# EAGLE design fc-hat-3v3fix (EAGLE 9.5.2)
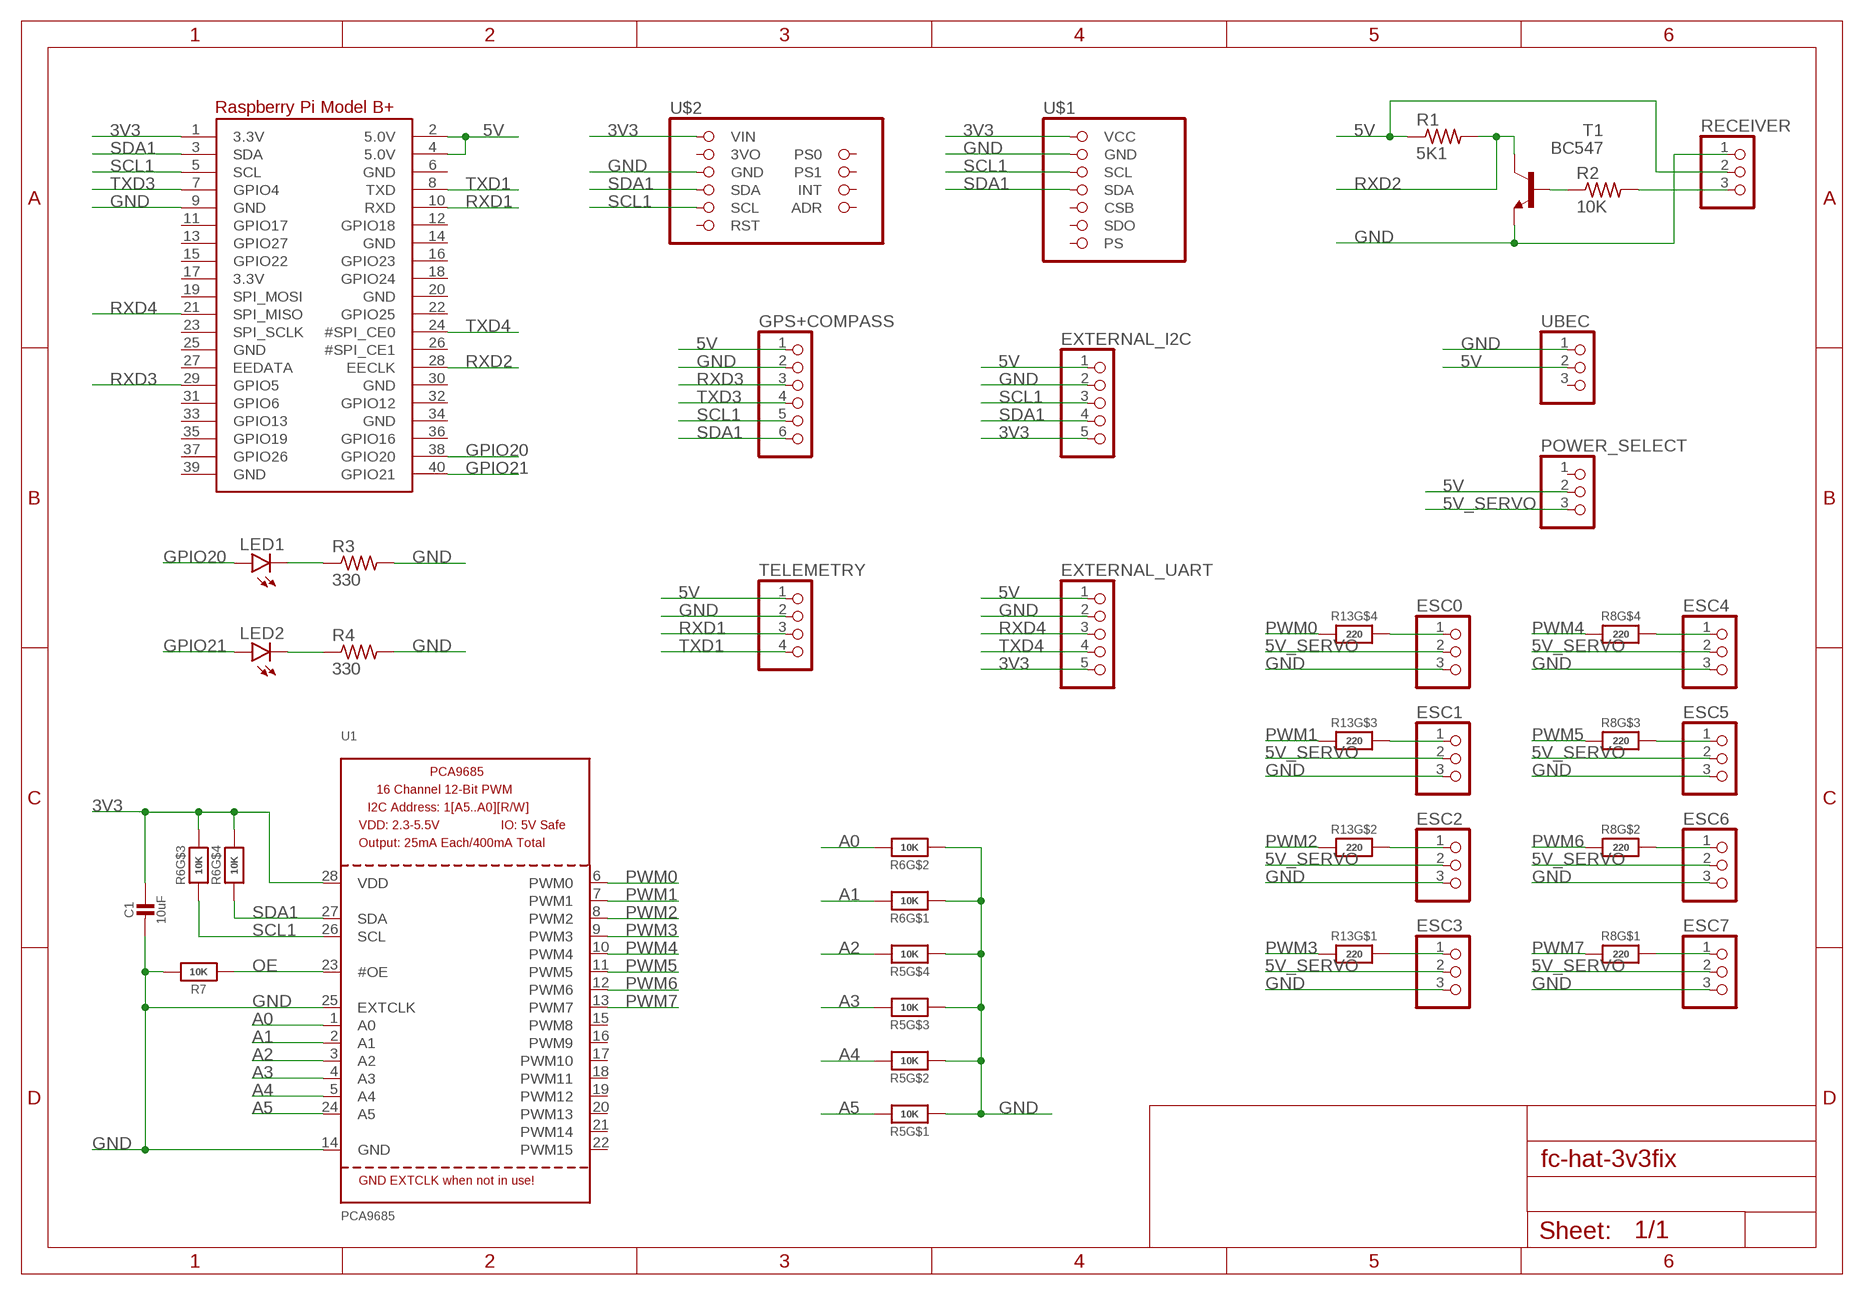
[diagram p0: schematic, sheet 1]

## Parts
C1  10uF  CAP_CERAMIC0805-NOOUTLINE  [0805-NO]
ESC0  PINHD-1X31X03_ROUND  [1X03_ROUND]
ESC1  PINHD-1X31X03_ROUND  [1X03_ROUND]
ESC2  PINHD-1X31X03_ROUND  [1X03_ROUND]
ESC3  PINHD-1X31X03_ROUND  [1X03_ROUND]
ESC4  PINHD-1X31X03_ROUND  [1X03_ROUND]
ESC5  PINHD-1X31X03_ROUND  [1X03_ROUND]
ESC6  PINHD-1X31X03_ROUND  [1X03_ROUND]
ESC7  PINHD-1X31X03_ROUND  [1X03_ROUND]
EXTERNAL_I2C  PINHD-1X51X05_ROUND  [1X05_ROUND]
EXTERNAL_UART  PINHD-1X51X05_ROUND  [1X05_ROUND]
GPS+COMPASS  PINHD-1X61X06_ROUND  [1X06_ROUND]
LED1  LED5MM  [LED5MM]
LED2  LED5MM  [LED5MM]
POWER_SELECT  PINHD-1X31X03_ROUND  [1X03_ROUND]
R1  5K1  R-US_0207/10  [0207/10]
R2  10K  R-US_0207/10  [0207/10]
R3  330  R-US_0207/10  [0207/10]
R4  330  R-US_0207/10  [0207/10]
R5  10K  RESISTOR_4PACK  [RESPACK_4X0603]
R6  10K  RESISTOR_4PACK  [RESPACK_4X0603]
R7  10K  RESISTOR0805_NOOUTLINE  [0805-NO]
R8  220  RESISTOR_4PACK  [RESPACK_4X0603]
R13  220  RESISTOR_4PACK  [RESPACK_4X0603]
RECEIVER  PINHD-1X31X03_ROUND  [1X03_ROUND]
RPI1  MICROBUILDER_RASPBERRYPI_BPLUS_HATNOSLOTS  [MICROBUILDER_PI_HAT_NOSLOTS]
T1  BC547  [TO92]
TELEMETRY  PINHD-1X41X04_ROUND  [1X04_ROUND]
U1  PCA9685  [TSSOP28]
U$1  GY-63  [GY-63]
U$2  BNO055  [BNO055]
UBEC  PINHD-1X31X03_ROUND  [1X03_ROUND]

## Nets
3V3: C1.1 EXTERNAL_I2C.5 EXTERNAL_UART.5 R6.5 R6.6 RPI1.1(3.3V) U1.28(VDD) U$1.VCC U$2.VIN
5V: EXTERNAL_I2C.1 EXTERNAL_UART.1 GPS+COMPASS.1 POWER_SELECT.2 R1.1 RECEIVER.2 RPI1.2(5.0V) RPI1.4(5.0V) TELEMETRY.1 UBEC.2
5V_SERVO: ESC0.2 ESC1.2 ESC2.2 ESC3.2 ESC4.2 ESC5.2 ESC6.2 ESC7.2 POWER_SELECT.3
A0: R6.7 U1.1(A0)
A1: R6.8 U1.2(A1)
A2: R5.5 U1.3(A2)
A3: R5.6 U1.4(A3)
A4: R5.7 U1.5(A4)
A5: R5.8 U1.24(A5)
GND: C1.2 ESC0.3 ESC1.3 ESC2.3 ESC3.3 ESC4.3 ESC5.3 ESC6.3 ESC7.3 EXTERNAL_I2C.2 EXTERNAL_UART.2 GPS+COMPASS.2 R3.2 R4.2 R5.1 R5.2 R5.3 R5.4 R6.1 R6.2 R7.2 RECEIVER.1 RPI1.9(GND) T1.1(E) TELEMETRY.2 U1.14(GND) U1.25(EXTCLK) U$1.GND U$2.GND UBEC.1
GPIO20: LED1.A RPI1.38(GPIO20)
GPIO21: LED2.A RPI1.40(GPIO21)
N$1: R2.2 RECEIVER.3
N$2: R2.1 T1.2(B)
N$3: LED1.K(C) R3.1
N$4: LED2.K(C) R4.1
N$5: ESC7.1 R8.8
N$6: ESC6.1 R8.7
N$7: ESC5.1 R8.6
N$8: ESC4.1 R8.5
N$10: ESC3.1 R13.8
N$11: ESC2.1 R13.7
N$12: ESC1.1 R13.6
N$13: ESC0.1 R13.5
OE: R7.1 U1.23(#OE)
PWM0: R13.4 U1.6(PWM0)
PWM1: R13.3 U1.7(PWM1)
PWM2: R13.2 U1.8(PWM2)
PWM3: R13.1 U1.9(PWM3)
PWM4: R8.4 U1.10(PWM4)
PWM5: R8.3 U1.11(PWM5)
PWM6: R8.2 U1.12(PWM6)
PWM7: R8.1 U1.13(PWM7)
RXD1: RPI1.10(RXD) TELEMETRY.3
RXD2: R1.2 RPI1.28(EECLK) T1.3(C)
RXD3: GPS+COMPASS.3 RPI1.29(GPIO5)
RXD4: EXTERNAL_UART.3 RPI1.21(SPI_MISO)
SCL1: EXTERNAL_I2C.3 GPS+COMPASS.5 R6.3 RPI1.5(SCL) U1.26(SCL) U$1.SCL U$2.SCL
SDA1: EXTERNAL_I2C.4 GPS+COMPASS.6 R6.4 RPI1.3(SDA) U1.27(SDA) U$1.SDA U$2.SDA
TXD1: RPI1.8(TXD) TELEMETRY.4
TXD3: GPS+COMPASS.4 RPI1.7(GPIO4)
TXD4: EXTERNAL_UART.4 RPI1.24(#SPI_CE0)
Unconnected: POWER_SELECT.1 RPI1.6(GND) RPI1.11(GPIO17) RPI1.12(GPIO18) RPI1.13(GPIO27) RPI1.14(GND) RPI1.15(GPIO22) RPI1.16(GPIO23) RPI1.17(3.3V) RPI1.18(GPIO24) RPI1.19(SPI_MOSI) RPI1.20(GND) RPI1.22(GPIO25) RPI1.23(SPI_SCLK) RPI1.25(GND) RPI1.26(#SPI_CE1) RPI1.27(EEDATA) RPI1.30(GND) RPI1.31(GPIO6) RPI1.32(GPIO12) RPI1.33(GPIO13) RPI1.34(GND) RPI1.35(GPIO19) RPI1.36(GPIO16) RPI1.37(GPIO26) RPI1.39(GND) U1.15(PWM8) U1.16(PWM9) U1.17(PWM10) U1.18(PWM11) U1.19(PWM12) U1.20(PWM13) U1.21(PWM14) U1.22(PWM15) U$1.CSB U$1.PS U$1.SDO U$2.3VO U$2.ADR U$2.INT U$2.PS0 U$2.PS1 U$2.RST UBEC.3

## Library data of the parts
C1 = microbuilder:CAP_CERAMIC: Ceramic Capacitors For new designs, use the packages preceded by an '_' character since they are more reliable: The following footprints should be used on most boards: _0402 - Standard footprint for regular board layouts _0603 - Standard footprint for regular board layouts _0805 - Standard footprint for regular board layouts _1206 - Standard footprint for regular board layouts For extremely tight-pitch boards where space is at a premium, the following 'micro-pitch' footprints can be used (smaller pads, no silkscreen outline, etc.): _0402MP - Micro-pitch footprint for very dense/compact boards _0603MP - Micro-pitch footprint for very dense/compact boards _0805MP - Micro-pitch footprint for very dense/compact boards _1206MP - Micro-pitch footprint for very dense/compact boards
ESC0 ESC1-ESC7 POWER_SELECT RECEIVER UBEC = custom_pinhead:PINHD-1X3: PIN HEADER
EXTERNAL_I2C EXTERNAL_UART = custom_pinhead:PINHD-1X5: PIN HEADER
GPS+COMPASS = custom_pinhead:PINHD-1X6: PIN HEADER
LED1 LED2 = led:LED: LED OSRAM: - CHIPLED LG R971, LG N971, LY N971, LG Q971, LY Q971, LO R971, LY R971 LH N974, LH R974 LS Q976, LO Q976, LY Q976 LO Q996 - Hyper CHIPLED LW Q18S LB Q993, LB Q99A, LB R99A - SideLED LS A670, LO A670, LY A670, LG A670, LP A670 LB A673, LV A673, LT A673, LW A673 LH A674 LY A675 LS A676, LA A676, LO A676, LY A676, LW A676 LS A679, LY A679, LG A679 - Hyper Micro SIDELED® LS Y876, LA Y876, LO Y876, LY Y876 LT Y87S - SmartLED LW L88C, LW L88S LB L89C, LB L89S, LG L890 LS L89K, LO L89K, LY L89K LS L896, LA L896, LO L896, LY L896 - TOPLED LS T670, LO T670, LY T670, LG T670, LP T670 LSG T670, LSP T670, LSY T670, LOP T670, LYG T670 LG T671, LOG T671, LSG T671 LB T673, LV T673, LT T673, LW T673 LH T674 LS T676, LA T676, LO T676, LY T676, LB T676, LH T676, LSB T676, LW T676 LB T67C, LV T67C, LT T67C, LS T67K, LO T67K, LY T67K, LW E67C LS E67B, LA E67B, LO E67B, LY E67B, LB E67C, LV E67C, LT E67C LW T67C LS T679, LY T679, LG T679 LS T770, LO T770, LY T770, LG T770, LP T770 LB T773, LV T773, LT T773, LW T773 LH T774 LS E675, LA E675, LY E675, LS T675 LS T776, LA T776, LO T776, LY T776, LB T776 LHGB T686 LT T68C, LB T68C - Hyper Mini TOPLED® LB M676 - Mini TOPLED Santana® LG M470 LS M47K, LO M47K, LY M47K Source: http://www.osram.convergy.de LUXEON: - LUMILED® LXK2-PW12-R00, LXK2-PW12-S00, LXK2-PW14-U00, LXK2-PW14-V00 LXK2-PM12-R00, LXK2-PM12-S00, LXK2-PM14-U00 LXK2-PE12-Q00, LXK2-PE12-R00, LXK2-PE12-S00, LXK2-PE14-T00, LXK2-PE14-U00 LXK2-PB12-K00, LXK2-PB12-L00, LXK2-PB12-M00, LXK2-PB14-N00, LXK2-PB14-P00, LXK2-PB14-Q00 LXK2-PR12-L00, LXK2-PR12-M00, LXK2-PR14-Q00, LXK2-PR14-R00 LXK2-PD12-Q00, LXK2-PD12-R00, LXK2-PD12-S00 LXK2-PH12-R00, LXK2-PH12-S00 LXK2-PL12-P00, LXK2-PL12-Q00, LXK2-PL12-R00 Source: www.luxeon.com KINGBRIGHT: KA-3528ASYC Source: www.kingbright.com
R1-R4 = rcl:R-US_: RESISTOR, American symbol; SPICEPREFIX: R
R5 R6 R8 R13 = microbuilder:RESISTOR_4PACK: Resistor Packs (4 resistors) 4 x 0603 10K 1/16W - Digikey: YC164J-10KCT-ND
R7 = microbuilder:RESISTOR: Resistors For new designs, use the packages preceded by an '_' character since they are more reliable: The following footprints should be used on most boards: _0402 - Standard footprint for regular board layouts _0603 - Standard footprint for regular board layouts _0805 - Standard footprint for regular board layouts _1206 - Standard footprint for regular board layouts For extremely tight-pitch boards where space is at a premium, the following 'micro-pitch' footprints can be used (smaller pads, no silkscreen outline, etc.): _0402MP - Micro-pitch footprint for very dense/compact boards _0603MP - Micro-pitch footprint for very dense/compact boards _0805MP - Micro-pitch footprint for very dense/compact boards _1206MP - Micro-pitch footprint for very dense/compact boards
RPI1 = Adafruit HaD Proto HAT rev A:MICROBUILDER_RASPBERRYPI_BPLUS
T1 = transistor:BC547: NPN TRANSISTOR
TELEMETRY = custom_pinhead:PINHD-1X4: PIN HEADER
U1 = microbuilder:PCA9685: PCA9685 - 16 Channel 12-Bit I2C PWM Controller 5.0V tolerant 16 channel, 12-bit I2C PWM controller with 25mA per output (max. 400mA total) Digikey: 568-5931-1-ND
U$1 = GY-63:GY-63
U$2 = AdafruitBNO055:BNO055

## Board
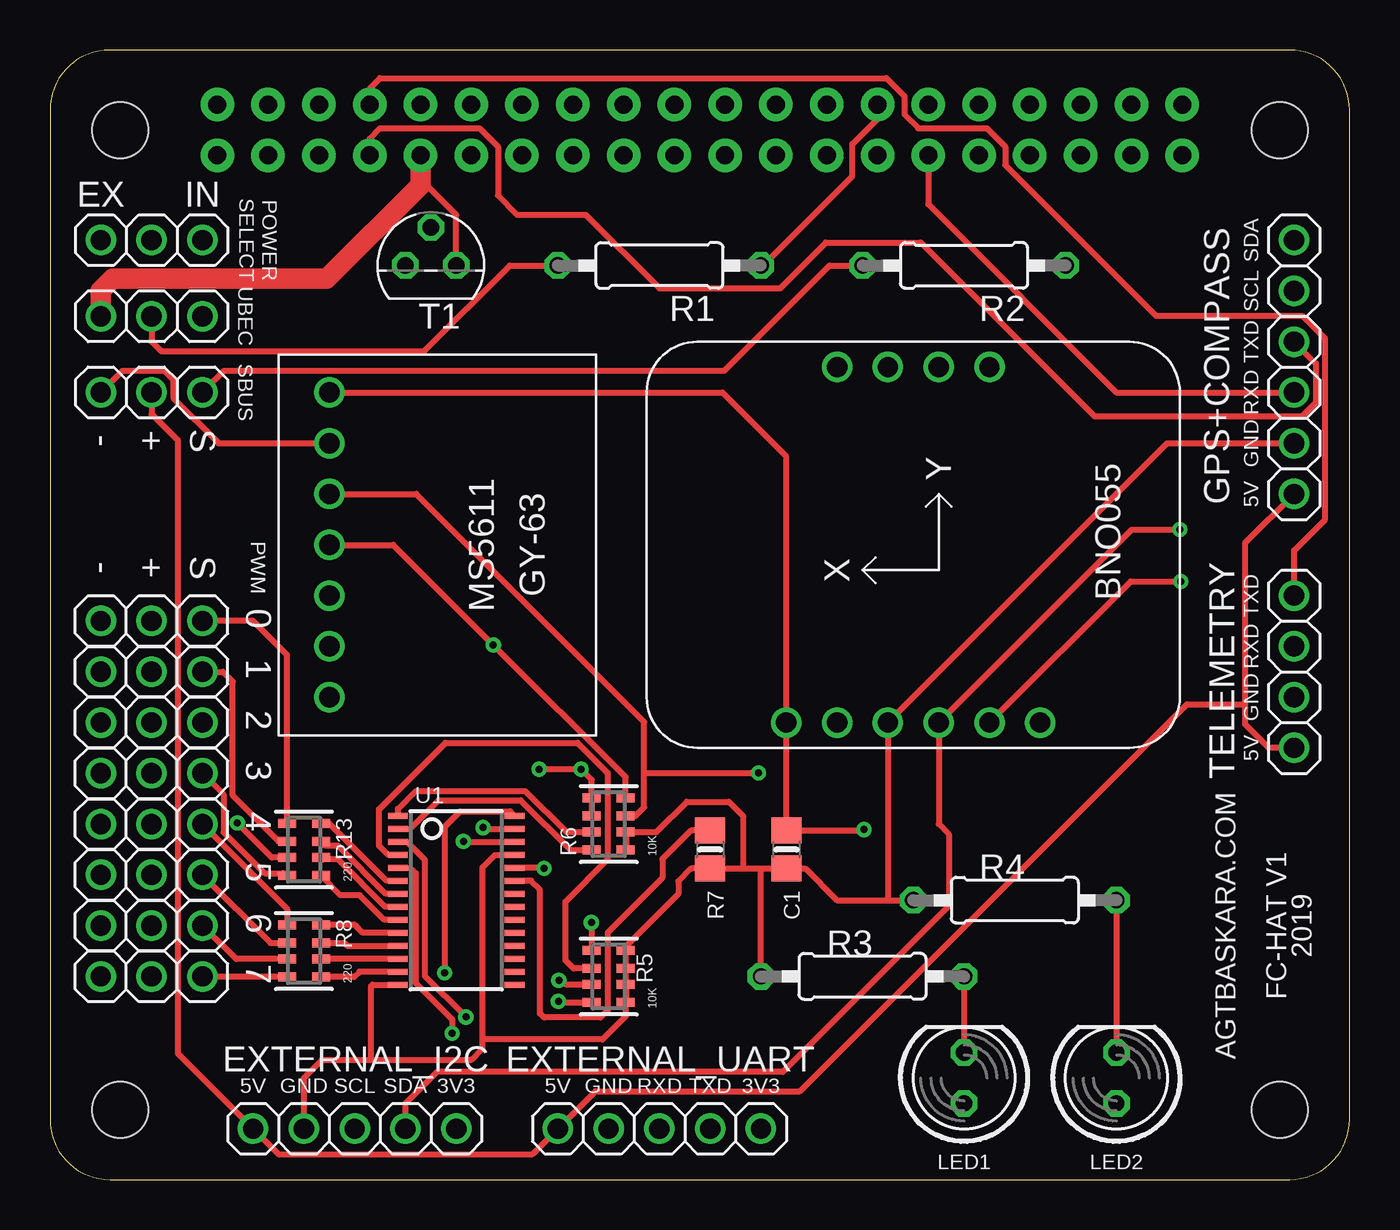
[diagram p1: board, top side]
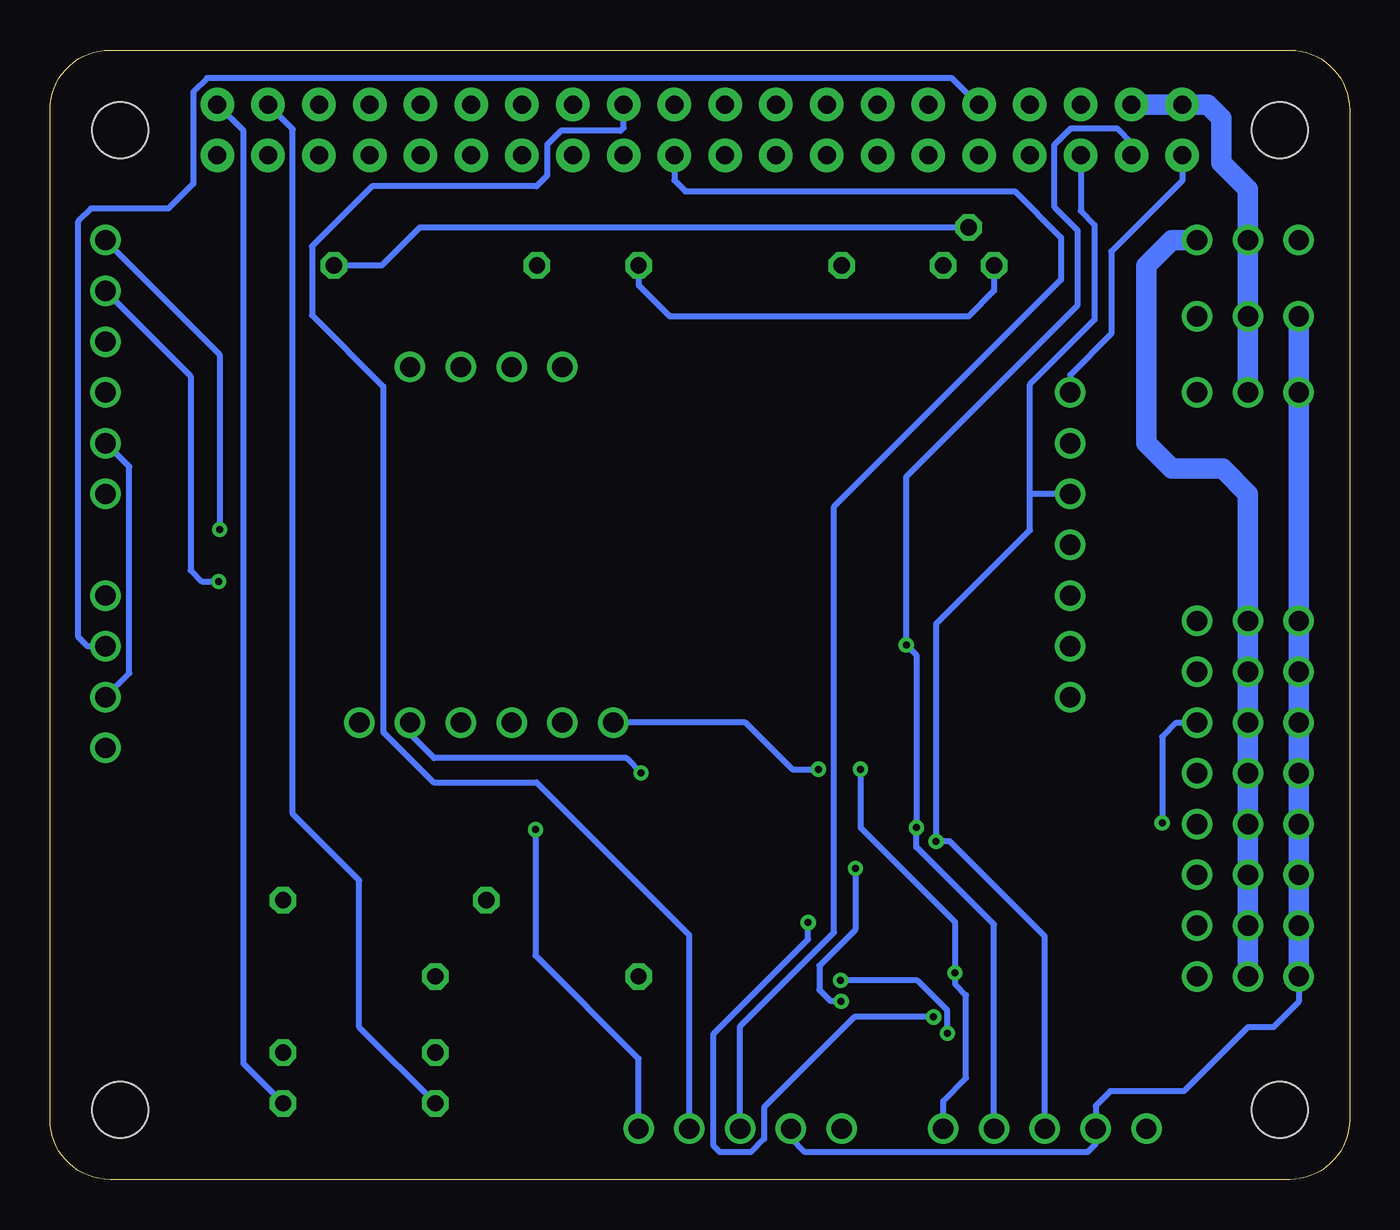
[diagram p2: board, bottom side, seen from below]

Size 65 x 56.5 mm. Coordinates in mm from the lower left corner, seen from the top.
Copper layers (1*16): Top 0.035mm / dielectric 1.5mm / Bottom 0.035mm
Design rules "default *": minimum track width 12mil, minimum drill 0.35mm, track to track 6mil, track to pad 6mil, pad to pad 6mil, via to via 6mil, smd to smd 6mil, copper to edge 40mil, drill to drill 6mil, minimum pad ring 10mil, minimum via ring 8mil, stop-mask expansion 4mil, vias tented up to drill 0mil, thermal gap 10mil

### Footprints (pad centres in the part's own frame; a part is rotated, then mirrored left to right if it is on the bottom)
0805-NO = smd 1.3 x 1.5: 1 -0.95,0; 2 0.95,0
1X03_ROUND = drill 1.016: 1 -2.54,0; 2 0,0; 3 2.54,0
1X05_ROUND = drill 1.016: 1 -5.08,0; 2 -2.54,0; 3 0,0; 4 2.54,0; 5 5.08,0
1X06_ROUND = drill 1.016: 1 -6.35,0; 2 -3.81,0; 3 -1.27,0; 4 1.27,0; 5 3.81,0; 6 6.35,0
LED5MM = drill 0.813 octagon: A -1.27,0; K 1.27,0
0207/10 = drill 0.813 octagon: 1 -5.08,0; 2 5.08,0
RESPACK_4X0603 = smd 0.45 x 0.9: 1 -1.3,-0.85; 2 -0.4,-0.85; 3 0.4,-0.85; 4 1.3,-0.85; 5 1.3,0.85; 6 0.4,0.85; 7 -0.4,0.85; 8 -1.3,0.85
MICROBUILDER_PI_HAT_NOSLOTS = drill 0.9 pad 1.676: 1 8.37,51.23; 2 8.37,53.77; 3 10.91,51.23; 4 10.91,53.77; 5 13.45,51.23; 6 13.45,53.77; 7 15.99,51.23; 8 15.99,53.77; 9 18.53,51.23; 10 18.53,53.77; 11 21.07,51.23; 12 21.07,53.77; 13 23.61,51.23; 14 23.61,53.77; 15 26.15,51.23; 16 26.15,53.77; 17 28.69,51.23; 18 28.69,53.77; 19 31.23,51.23; 20 31.23,53.77; 21 33.77,51.23; 22 33.77,53.77; 23 36.31,51.23; 24 36.31,53.77; 25 38.85,51.23; 26 38.85,53.77; 27 41.39,51.23; 28 41.39,53.77; 29 43.93,51.23; 30 43.93,53.77; 31 46.47,51.23; 32 46.47,53.77; 33 49.01,51.23; 34 49.01,53.77; 35 51.55,51.23; 36 51.55,53.77; 37 54.09,51.23; 38 54.09,53.77; 39 56.63,51.23; 40 56.63,53.77 | hole 2.8: 3.5,3.5; 3.5,52.5; 61.5,52.5; 61.5,3.5
TO92 = drill 0.813 octagon: 1 1.27,0; 2 0,1.905; 3 -1.27,0
1X04_ROUND = drill 1.016: 1 -3.81,0; 2 -1.27,0; 3 1.27,0; 4 3.81,0
TSSOP28 = smd 0.305 x 0.991: 1 -4.225,-2.918; 2 -3.575,-2.918; 3 -2.925,-2.918; 4 -2.275,-2.918; 5 -1.625,-2.918; 6 -0.975,-2.918; 7 -0.325,-2.918; 8 0.325,-2.918; 9 0.975,-2.918; 10 1.625,-2.918; 11 2.275,-2.918; 12 2.925,-2.918; 13 3.575,-2.918; 14 4.225,-2.918; 15 4.225,2.918; 16 3.575,2.918; 17 2.925,2.918; 18 2.275,2.918; 19 1.625,2.918; 20 0.975,2.918; 21 0.325,2.918; 22 -0.325,2.918; 23 -0.975,2.918; 24 -1.625,2.918; 25 -2.275,2.918; 26 -2.925,2.918; 27 -3.575,2.918; 28 -4.225,2.918
GY-63 = drill 1.016: CSB -8.89,-1.27; GND -8.89,6.35; PS -8.89,-6.35; SCL -8.89,3.81; SDA -8.89,1.27; SDO -8.89,-3.81; VCC -8.89,8.89
BNO055 = drill 1.016: 3VO -8.89,3.81; ADR 8.89,-3.81; GND -8.89,1.27; INT 8.89,-1.27; PS0 8.89,3.81; PS1 8.89,1.27; RST -8.89,-6.35; SCL -8.89,-3.81; SDA -8.89,-1.27; VIN -8.89,6.35

### Placement (x,y rotation side)
C1  36.83,16.51 270 top
ESC0  5.08,27.94 180 top
ESC1  5.08,25.4 180 top
ESC2  5.08,22.86 180 top
ESC3  5.08,20.32 180 top
ESC4  5.08,17.78 180 top
ESC5  5.08,15.24 180 top
ESC6  5.08,12.7 180 top
ESC7  5.08,10.16 180 top
EXTERNAL_I2C  15.24,2.54 0 top
EXTERNAL_UART  30.48,2.54 0 top
GPS+COMPASS  62.23,40.64 90 top
LED1  45.72,5.08 90 top
LED2  53.34,5.08 90 top
POWER_SELECT  5.08,46.99 0 top
R1  30.48,45.72 0 top
R2  45.72,45.72 180 top
R3  40.64,10.16 180 top
R4  48.26,13.97 180 top
R5  27.94,10.16 90 top
R6  27.94,17.78 90 top
R7  33.02,16.51 270 top
R8  12.7,11.43 90 top
R13  12.7,16.51 90 top
RECEIVER  5.08,39.37 0 top
RPI1  0,0 0 top
T1  19.05,45.72 0 top
TELEMETRY  62.23,25.4 90 top
U1  20.32,13.97 270 top
U$1  22.86,30.48 0 top
U$2  43.18,31.75 90 top
UBEC  5.08,43.18 0 top

### Tracks (layer width: path | path; a pad name or v marks a point on that pad's centre or on a via)
3V3  (via drill 0.35)
  Top 0.305: v19.74,10.34 19.74,17.63 20.52,18.41 23.02,18.41 U1.28 | 36.8,22.86 36.8,36.2 33.63,39.37 U$1.VCC | 36.8,22.86 36.8,17.6 C1.1 40.68,17.46 v40.72,17.5 | v24.46,20.52 v26.57,20.52 27.09,20 R6.5 R6.6 | 36.8,22.86 U$2.VIN
  Bottom 0.305: v26.57,20.52 27.86,20.52 30.2,22.86 U$2.VIN | v40.72,17.5 40.72,11.2 35.56,6.04 EXTERNAL_UART.5 | v24.46,20.52 24.46,17.6 19.74,12.88 v19.74,10.34 19.74,9.78 19.18,9.22 19.18,5.08 20.32,3.94 EXTERNAL_I2C.5 | U$1.VCC 13.97,40.25 11.91,42.3 11.91,46.42 8.85,49.48 8.37,49.96 RPI1.1
5V
  Top 0.305: R1.1 23.01,45.72 18.72,41.43 5.56,41.43 5.08,41.91 UBEC.2 | 59.77,23.77 56.87,23.77 37.52,4.42 27.28,4.42 EXTERNAL_UART.1 24.13,1.27 11.43,1.27 EXTERNAL_I2C.1 6.4,6.3 6.4,36.96 5.08,38.28 RECEIVER.2 | TELEMETRY.1 60.96,21.59 59.77,22.78 59.77,23.77 | GPS+COMPASS.1 59.77,31.83 59.77,23.77
  Bottom 1.016: RECEIVER.2 UBEC.2 POWER_SELECT.2 5.08,49.53 6.42,50.87 6.42,53.09 7.1,53.77 RPI1.2 RPI1.4
5V_SERVO
  Bottom 1.016: ESC7.2 ESC6.2 ESC5.2 ESC4.2 ESC3.2 ESC2.2 ESC1.2 ESC0.2 5.08,34.29 6.35,35.56 8.89,35.56 10.16,36.83 10.16,45.72 8.89,46.99 POWER_SELECT.3
A0
  Top 0.305: R6.7 25.82,17.38 23.77,19.43 18.29,19.43 17.4,18.55 U1.1
A1
  Top 0.305: R6.8 26.04,16.48 23.55,18.97 19.43,18.97 18,17.55 U1.2
A2  (via drill 0.35)
  Top 0.305: v20.8,8.13 18.75,10.19 18.75,16 17.85,16.89 U1.3 | v27.08,12.85 v27.09,12.84 R5.5
  Bottom 0.305: v27.08,12.85 27.08,12.01 31.8,7.29 31.8,1.68 31.5,1.37 29.95,1.37 29.29,2.03 29.29,3.61 24.77,8.13 v20.8,8.13
A3
  Top 0.305: R5.6 26.19,10.56 25.78,10.97 25.78,13.89 27.89,16 27.89,20.34 26.39,21.84 19.79,21.84 16.46,18.52 16.46,16.69 16.9,16.25 U1.4
A4  (via drill 0.35)
  Top 0.305: v25.45,9.96 25.5,9.96 25.82,9.76 R5.7 | v20.12,7.32 20.12,8 18.29,9.83 18.29,15.32 18.01,15.6 U1.5
  Bottom 0.305: v25.45,9.96 21.61,9.96 20.12,8.46 v20.12,7.32
A5  (via drill 0.35)
  Top 0.305: v25.43,8.91 25.7,8.91 25.82,8.86 R5.8 | v24.71,15.57 24.69,15.6 U1.24
  Bottom 0.305: v24.71,15.57 24.71,12.5 26.52,10.69 26.52,9.5 25.93,8.91 v25.43,8.91
GND
  Top 0.305: U$1.GND 8.43,36.83 6.17,39.09 6.17,40.01 5.71,40.46 3.63,40.46 RECEIVER.1 | 16.05,5.99 13.61,5.99 12.7,5.08 EXTERNAL_I2C.2 | U1.14 16.13,9.74 16.05,9.66 16.05,5.99 | 16.05,5.99 21.08,5.99 21.61,6.53 21.61,7.01 | U1.25 23.09,16.23 22.25,16.23 21.61,15.6 21.61,7.01 | R6.1 28.8,16.69 28.8,17.37 R6.2 30.33,17.38 31.85,18.9 33.96,18.9 34.67,18.19 34.67,15.56 | 41.91,13.97 39.37,13.97 37.78,15.56 C1.2 35.56,15.56 | 41.91,13.97 R4.2 | 34.67,15.56 R7.2 32.07,15.56 31.43,14.92 31.43,14.29 28.8,11.66 R5.4 28.8,11.43 28.8,10.74 R5.3 28.8,10.52 28.8,9.83 R5.2 28.8,9.6 28.8,8.91 R5.1 28.79,8.16 27.64,7.01 21.61,7.01 | 34.67,15.56 35.56,15.56 | R3.2 35.56,15.56 | 41.91,13.97 U$2.GND 55.88,36.83 GPS+COMPASS.2 | T1.1 20.32,48.26 18.83,49.75 18.53,49.75
  Top 1.016: UBEC.1 2.54,44.45 3.15,45.06 13.84,45.06 18.53,49.75 RPI1.9
  Bottom 0.305: EXTERNAL_UART.2 27.94,2.08 27.23,1.37 13.11,1.37 12.7,1.78 EXTERNAL_I2C.2 12.7,3.68 11.96,4.42 8.28,4.42 5.08,7.62 3.81,7.62 2.54,8.89 ESC7.3 | GPS+COMPASS.2 62.18,36.8 61.04,35.66 61.04,25.32 TELEMETRY.2
  Bottom 1.016: ESC7.3 ESC6.3 ESC5.3 ESC4.3 ESC3.3 ESC2.3 ESC1.3 ESC0.3 RECEIVER.1 UBEC.1
GPIO20
  Bottom 0.305: RPI1.38 52.85,52.53 52.85,18.28 49.53,14.96 49.53,7.62 LED1.A
GPIO21
  Bottom 0.305: RPI1.40 55.32,52.46 55.32,5.79 LED2.A
N$1
  Top 0.305: R2.2 38.99,45.72 33.73,40.46 8.71,40.46 RECEIVER.3
N$2
  Bottom 0.305: R2.1 48.41,45.72 46.51,47.62 T1.2
N$3
  Top 0.305: R3.1 LED1.K
N$4
  Top 0.305: R4.1 LED2.K
N$5
  Top 0.305: ESC7.1 11.82,10.16 R8.8
N$6
  Top 0.305: ESC6.1 7.77,12.57 9.31,11.03 R8.7
N$7
  Top 0.305: R8.6 11.03,11.83 ESC5.1
N$8
  Top 0.305: ESC4.1 11.85,13.55 R8.5
N$10
  Top 0.305: R13.8 11.66,15.32 10.74,15.32 8.69,17.37 8.69,19.25 ESC3.1
N$11  (via drill 0.35)
  Top 0.305: R13.7 11.09,16.11 v9.37,17.83
  Bottom 0.305: v9.37,17.83 9.37,22.15 8.66,22.86 ESC2.1
N$12
  Top 0.305: ESC1.1 8.65,25.4 9.14,24.91 9.14,19.2 11.44,16.91 R13.6
N$13
  Top 0.305: ESC0.1 10.16,27.94 11.85,26.25 R13.5
OE
  Top 0.305: U1.23 24.07,14.95 24.51,14.5 24.51,8.31 24.71,8.1 27.53,8.1 27.89,8.46 27.89,12.34 30.63,15.09 30.63,16.03 32.06,17.46 R7.1
PWM0
  Top 0.305: R13.4 13.96,17.81 16.83,14.95 U1.6
PWM1
  Top 0.305: R13.3 13.77,16.69 14.4,16.69 16.8,14.29 U1.7
PWM2
  Top 0.305: R13.2 13.66,16 14.4,16 16.76,13.64 U1.8
PWM3
  Top 0.305: R13.1 14.54,14.22 15.49,14.22 16.72,12.99 U1.9
PWM4
  Top 0.305: R8.4 15.25,12.73 15.42,12.57 15.65,12.34 17.37,12.34 U1.10
PWM5
  Top 0.305: U1.11 14.86,11.7 14.73,11.83 R8.3
PWM6
  Top 0.305: U1.12 13.56,11.04 R8.2
PWM7
  Top 0.305: U1.13 15.47,10.39 15.21,10.13 R8.1
RXD1
  Bottom 0.305: RPI1.10 18.75,53.95 19.89,55.09 57.15,55.09 57.84,54.41 57.84,49.81 59.08,48.56 62.94,48.56 63.58,47.93 63.58,27.13 63.12,26.67 TELEMETRY.3
RXD2
  Top 0.305: RPI1.28 41.38,53.72 41.38,53.03 40.13,51.79 40.13,50.19 35.66,45.72 R1.2
  Bottom 0.305: R1.2 35.56,44.73 34.01,43.18 19.05,43.18 17.78,44.45 T1.3
RXD3
  Top 0.305: RPI1.29 43.93,48.78 53.34,39.37 GPS+COMPASS.3
RXD4
  Bottom 0.305: RPI1.21 33.77,49.98 33.22,49.43 16.74,49.43 14.43,47.12 14.43,45.01 25.78,33.66 25.78,12.37 30.48,7.67 EXTERNAL_UART.3
SCL1  (via drill 0.35)
  Top 0.305: v20.68,16.92 20.65,16.89 U1.26 | 29.72,20.34 29.72,18.62 29.28,18.18 R6.3 | 29.72,20.34 29.72,22.89 18.31,34.29 U$1.SCL | 29.72,20.34 v35.43,20.34 | U$2.SCL 54.05,29.92 v56.57,29.92
  Bottom 0.305: U$2.SCL 46.99,22.28 45.8,21.08 36.17,21.08 v35.43,20.34 | 15.98,34.29 15.98,32.49 20.68,27.79 v20.68,16.92 19.99,16.92 15.24,12.17 EXTERNAL_I2C.3 | 15.98,34.29 15.98,39.78 12.75,43 12.75,47.75 13.45,48.45 RPI1.5 | GPS+COMPASS.5 57.96,40.18 57.96,30.48 57.4,29.92 v56.57,29.92 | U$1.SCL 15.98,34.29
SDA1  (via drill 0.35)
  Top 0.305: v21.67,17.6 21.67,17.55 U1.27 | EXTERNAL_I2C.4 17.78,3.81 19.36,5.38 36.65,5.38 44.96,13.69 44.96,17.27 44.45,17.78 U$2.SDA 54.1,32.51 v56.52,32.51 | U$1.SDA 17.17,31.75 v22.17,26.75 28.79,20.13 R6.4
  Bottom 0.305: RPI1.3 10.91,51.86 11.62,52.58 13.95,52.58 14.76,51.77 14.76,48.64 13.59,47.47 13.59,43.74 22.17,35.15 v22.17,26.75 21.67,26.24 v21.67,17.6 21.67,16.64 17.78,12.75 EXTERNAL_I2C.4 | GPS+COMPASS.6 56.52,41.27 v56.52,32.51
TXD1
  Top 0.305: RPI1.8 15.99,54.57 16.51,55.09 41.83,55.09 42.75,54.18 42.75,53.26 43.43,52.58 46.86,52.58 47.78,51.66 47.78,50.75 55.32,43.2 62.64,43.2 63.78,42.06 63.78,33.02 62.23,31.47 TELEMETRY.4
TXD3
  Top 0.305: RPI1.7 15.99,52.07 16.5,52.58 21.49,52.58 22.4,51.66 22.4,49.23 23.37,48.26 26.8,48.26 30.48,44.58 36.52,44.58 38.81,46.86 43.56,46.86 52.25,38.18 62.64,38.18 63.32,38.86 63.32,40.82 GPS+COMPASS.4
TXD4
  Bottom 0.305: RPI1.24 36.31,52.61 36.46,52.45 39.45,52.45 40.13,51.77 40.13,50.22 40.66,49.68 48.9,49.68 51.89,46.69 51.89,43.23 48.34,39.67 48.34,22.38 45.82,19.86 40.66,19.86 33.02,12.22 EXTERNAL_UART.4

### Text on the board
tNames: EX | IN | POWER / SELECT | SDA | SCL | UBEC | TXD | SBUS | RXD | - | + | S | GND | 5V | - | + | S | PWM | TXD | 0 | RXD | 1 | GND | 2 | 5V | 3 | 4 | 5 | 6 | AGTBASKARA.COM | FC-HAT V1 | 2019 | 7 | 5V | GND | SCL | SDA | 3V3 | 5V | GND | RXD | TXD | 3V3 | LED1 | LED2